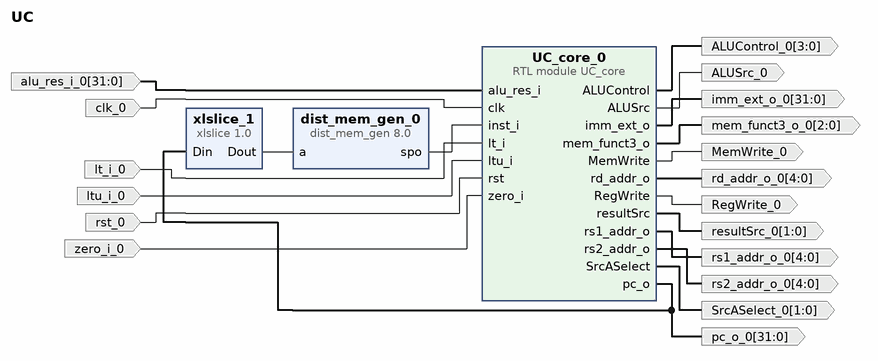
[diagram p0: block diagram of the top level]
# Vivado block design UC, xc7a100tcsg324-1, Vivado 2025.1
create_bd_design UC

create_bd_port -dir I -from 31 -to 0 alu_res_i_0
create_bd_port -dir I -type rst rst_0
create_bd_port -dir I zero_i_0
create_bd_port -dir I lt_i_0
create_bd_port -dir I ltu_i_0
create_bd_port -dir I -type clk clk_0
create_bd_port -dir O -from 4 -to 0 rs2_addr_o_0
create_bd_port -dir O -from 4 -to 0 rd_addr_o_0
create_bd_port -dir O ALUSrc_0
create_bd_port -dir O -from 31 -to 0 imm_ext_o_0
create_bd_port -dir O MemWrite_0
create_bd_port -dir O RegWrite_0
create_bd_port -dir O -from 2 -to 0 mem_funct3_o_0
create_bd_port -dir O -from 1 -to 0 resultSrc_0
create_bd_port -dir O -from 1 -to 0 SrcASelect_0
create_bd_port -dir O -from 3 -to 0 ALUControl_0
create_bd_port -dir O -from 4 -to 0 rs1_addr_o_0
create_bd_port -dir O -from 31 -to 0 pc_o_0

create_bd_cell -type ip -vlnv xilinx.com:ip:dist_mem_gen:8.0 dist_mem_gen_0
set_property -dict [list \
  CONFIG.coefficient_file ../../../../../../build/firmware/led_binary_demo.coe \
  CONFIG.data_width 32 \
  CONFIG.default_data 00000013 \
  CONFIG.depth 256 \
  CONFIG.memory_type rom \
] [get_bd_cells dist_mem_gen_0]
create_bd_cell -type module -reference UC_core UC_core_0
create_bd_cell -type ip -vlnv xilinx.com:ip:xlslice:1.0 xlslice_1
set_property -dict {CONFIG.DIN_FROM 7 CONFIG.DIN_TO 2} [get_bd_cells xlslice_1]

# ---- connections ----

connect_bd_net [get_bd_pins UC_core_0/ALUControl] [get_bd_ports ALUControl_0]
connect_bd_net [get_bd_pins UC_core_0/ALUSrc] [get_bd_ports ALUSrc_0]
connect_bd_net [get_bd_pins UC_core_0/MemWrite] [get_bd_ports MemWrite_0]
connect_bd_net [get_bd_pins UC_core_0/RegWrite] [get_bd_ports RegWrite_0]
connect_bd_net [get_bd_pins UC_core_0/SrcASelect] [get_bd_ports SrcASelect_0]
connect_bd_net [get_bd_pins UC_core_0/imm_ext_o] [get_bd_ports imm_ext_o_0]
connect_bd_net [get_bd_pins UC_core_0/mem_funct3_o] [get_bd_ports mem_funct3_o_0]
connect_bd_net [get_bd_pins UC_core_0/pc_o] [get_bd_ports pc_o_0] [get_bd_pins xlslice_1/Din]
connect_bd_net [get_bd_pins UC_core_0/rd_addr_o] [get_bd_ports rd_addr_o_0]
connect_bd_net [get_bd_pins UC_core_0/resultSrc] [get_bd_ports resultSrc_0]
connect_bd_net [get_bd_pins UC_core_0/rs1_addr_o] [get_bd_ports rs1_addr_o_0]
connect_bd_net [get_bd_pins UC_core_0/rs2_addr_o] [get_bd_ports rs2_addr_o_0]
connect_bd_net -net alu_res_i_0_1 [get_bd_ports alu_res_i_0] [get_bd_pins UC_core_0/alu_res_i]
connect_bd_net -net clk_0_1 [get_bd_ports clk_0] [get_bd_pins UC_core_0/clk]
connect_bd_net [get_bd_pins dist_mem_gen_0/spo] [get_bd_pins UC_core_0/inst_i]
connect_bd_net -net lt_i_0_1 [get_bd_ports lt_i_0] [get_bd_pins UC_core_0/lt_i]
connect_bd_net -net ltu_i_0_1 [get_bd_ports ltu_i_0] [get_bd_pins UC_core_0/ltu_i]
connect_bd_net -net rst_0_1 [get_bd_ports rst_0] [get_bd_pins UC_core_0/rst]
connect_bd_net [get_bd_pins xlslice_1/Dout] [get_bd_pins dist_mem_gen_0/a]
connect_bd_net -net zero_i_0_1 [get_bd_ports zero_i_0] [get_bd_pins UC_core_0/zero_i]

validate_bd_design
save_bd_design
